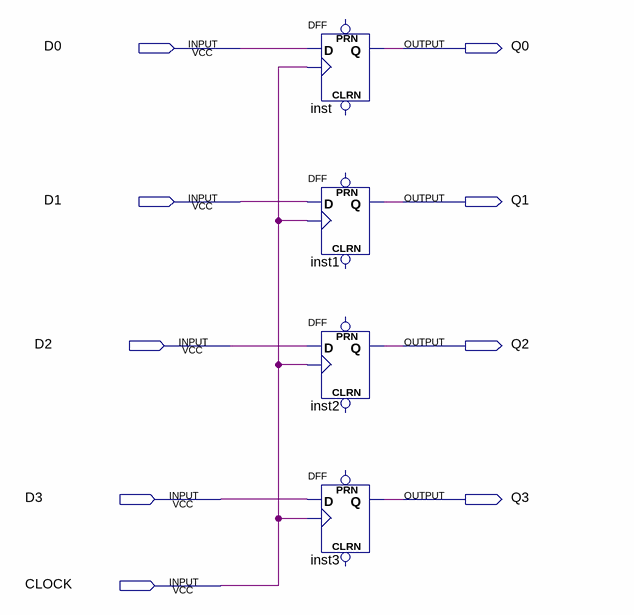
[diagram p0: schematic sheet]
// Quartus schematic 4_esc_registrador_paralelo.bdf as structural Verilog: 4 symbols, 9 pins
module \4_esc_registrador_paralelo  (
  input  D0,
  input  D1,
  input  D2,
  input  D3,
  input  CLOCK,
  output Q0,
  output Q1,
  output Q2,
  output Q3
);

  DFF inst (.CLK(CLOCK), .D(D0), .Q(Q0));  // open: CLRN, PRN
  DFF inst1 (.CLK(CLOCK), .D(D1), .Q(Q1));  // open: CLRN, PRN
  DFF inst2 (.CLK(CLOCK), .D(D2), .Q(Q2));  // open: CLRN, PRN
  DFF inst3 (.CLK(CLOCK), .D(D3), .Q(Q3));  // open: CLRN, PRN
endmodule
